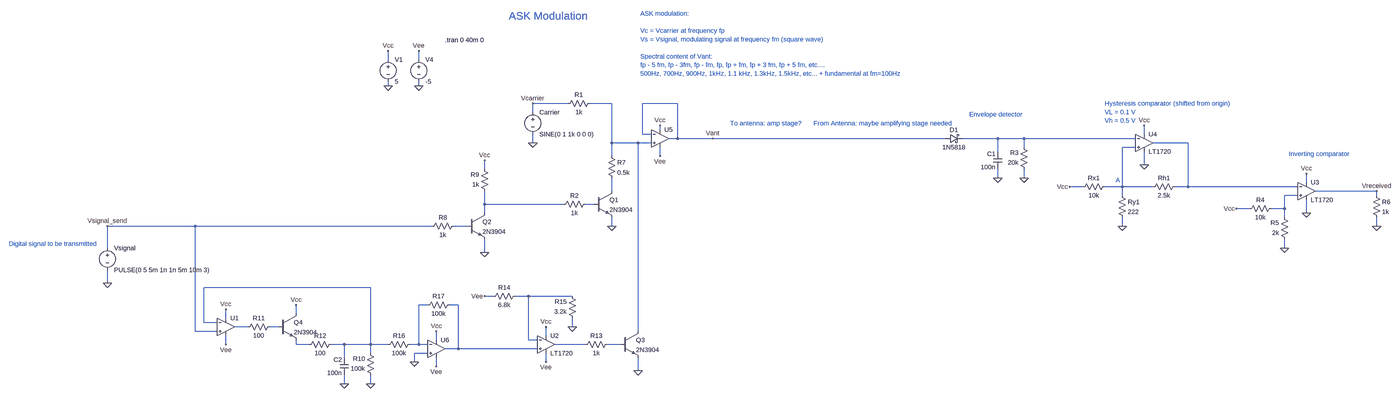
[diagram p0: schematic ASK-modulation2.asc, whole sheet]
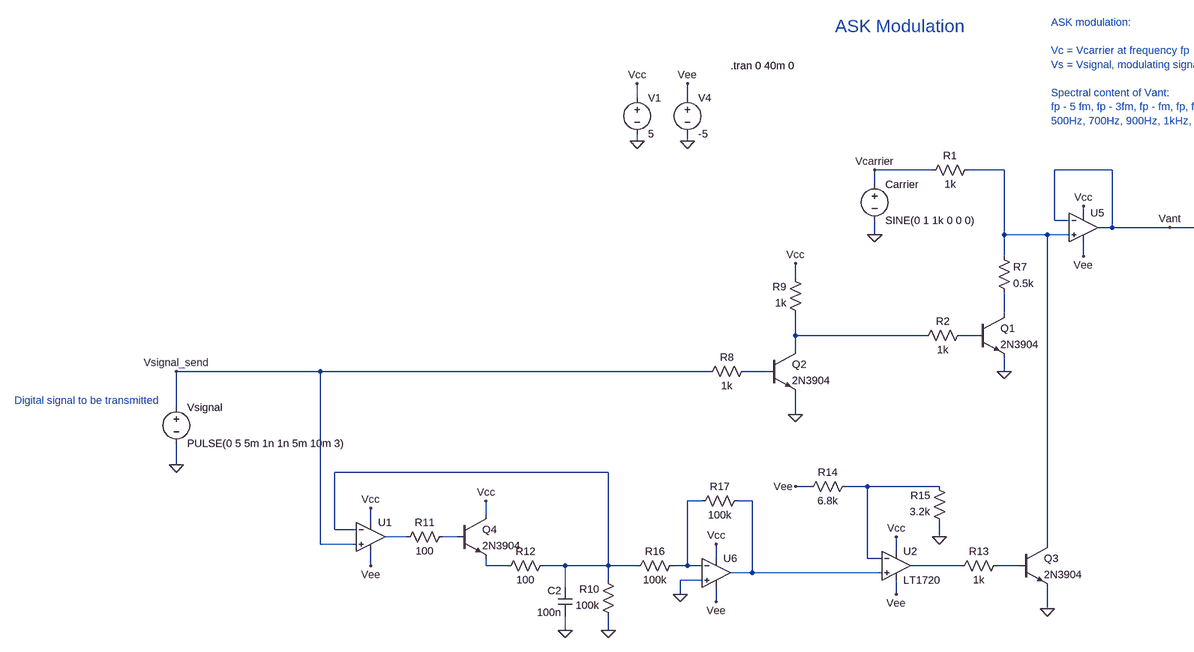
[diagram p1: schematic ASK-modulation2.asc, part, row 1 of 1, column 1 of 2]
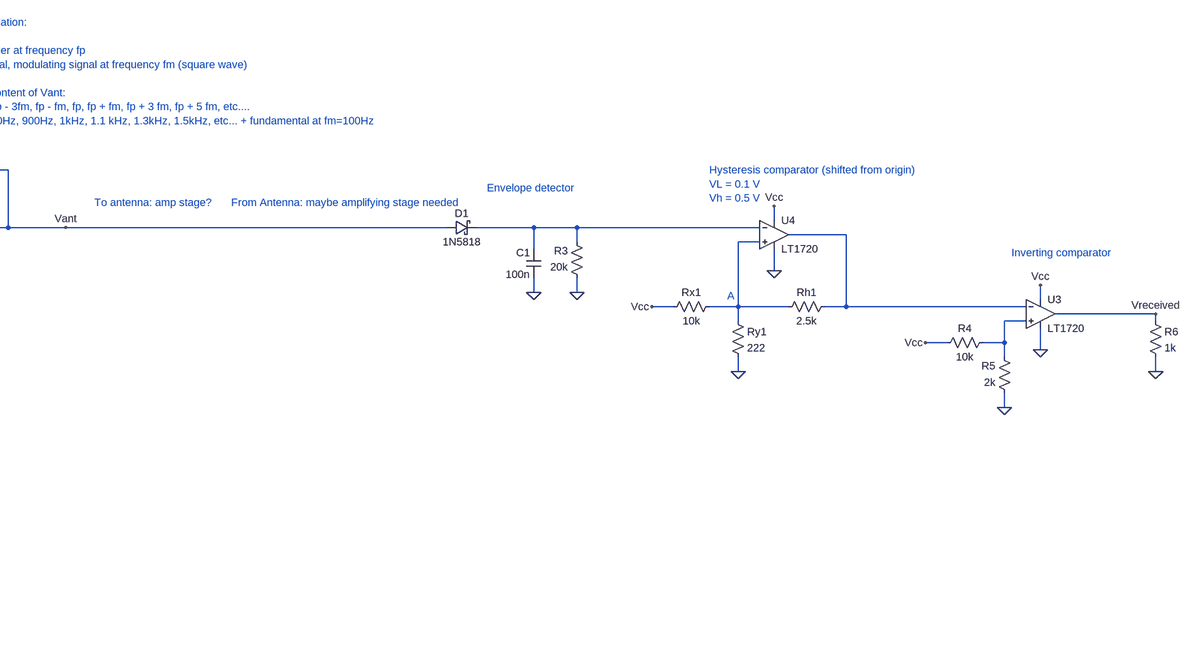
[diagram p2: schematic ASK-modulation2.asc, part, row 1 of 1, column 2 of 2]
ASK-modulation2.asc, the LTspice schematic file:
Version 4.1
SHEET 1 3624 1304
WIRE -1040 -96 -1040 -128
WIRE -928 -96 -928 -128
WIRE -1040 0 -1040 -16
WIRE -928 0 -928 -16
WIRE -384 64 -512 64
WIRE -224 64 -304 64
WIRE 16 64 -112 64
WIRE -512 96 -512 64
WIRE -48 160 -48 144
WIRE -112 176 -112 64
WIRE -80 176 -112 176
WIRE 1760 176 1760 144
WIRE 16 192 16 64
WIRE 16 192 -16 192
WIRE 144 192 16 192
WIRE 992 192 144 192
WIRE 1184 192 1056 192
WIRE 1280 192 1184 192
WIRE 1728 192 1280 192
WIRE -512 208 -512 176
WIRE -224 208 -224 64
WIRE -128 208 -224 208
WIRE -80 208 -128 208
WIRE 1920 208 1792 208
WIRE 1280 224 1280 192
WIRE 1728 224 1680 224
WIRE 1184 240 1184 192
WIRE -224 256 -224 208
WIRE -48 256 -48 224
WIRE 1760 288 1760 240
WIRE -688 304 -688 272
WIRE 1184 336 1184 304
WIRE 1280 336 1280 304
WIRE 2352 352 2352 320
WIRE 1536 368 1488 368
WIRE 1680 368 1680 224
WIRE 1680 368 1616 368
WIRE 1792 368 1680 368
WIRE 1920 368 1920 208
WIRE 1920 368 1872 368
WIRE 2320 368 1920 368
WIRE -224 384 -224 336
WIRE 2608 384 2384 384
WIRE 1680 400 1680 368
WIRE 2320 400 2272 400
WIRE 2608 400 2608 384
WIRE -688 432 -688 384
WIRE -400 432 -688 432
WIRE -288 432 -320 432
WIRE 2144 448 2096 448
WIRE 2272 448 2272 400
WIRE 2272 448 2224 448
WIRE -688 464 -688 432
WIRE 2352 464 2352 416
WIRE 2272 480 2272 448
WIRE -1744 512 -2064 512
WIRE -880 512 -1744 512
WIRE -752 512 -800 512
WIRE -224 512 -224 480
WIRE 1680 512 1680 480
WIRE 2608 512 2608 480
WIRE -2064 592 -2064 512
WIRE 2272 592 2272 560
WIRE -688 608 -688 560
WIRE -2064 720 -2064 672
WIRE -1104 736 -1712 736
WIRE -656 768 -688 768
WIRE -528 768 -576 768
WIRE -368 768 -528 768
WIRE -896 800 -928 800
WIRE -784 800 -816 800
WIRE -1376 832 -1376 800
WIRE -1632 848 -1632 816
WIRE -1712 864 -1712 736
WIRE -1664 864 -1712 864
WIRE -1552 880 -1600 880
WIRE -1440 880 -1472 880
WIRE -368 880 -368 848
WIRE -1744 896 -1744 512
WIRE -1664 896 -1744 896
WIRE -128 896 -128 208
WIRE -464 912 -464 880
WIRE -864 928 -864 896
WIRE -528 928 -528 768
WIRE -496 928 -528 928
WIRE -1632 944 -1632 912
WIRE -1376 944 -1376 928
WIRE -1328 944 -1376 944
WIRE -1200 944 -1248 944
WIRE -1104 944 -1104 736
WIRE -1104 944 -1200 944
WIRE -1040 944 -1104 944
WIRE -928 944 -928 800
WIRE -928 944 -960 944
WIRE -896 944 -928 944
WIRE -320 944 -432 944
WIRE -192 944 -240 944
WIRE -784 960 -784 800
WIRE -784 960 -832 960
WIRE -496 960 -784 960
WIRE -1104 976 -1104 944
WIRE -896 976 -944 976
WIRE -1200 992 -1200 944
WIRE -944 1008 -944 976
WIRE -464 1008 -464 976
WIRE -864 1024 -864 992
WIRE -128 1040 -128 992
WIRE -1200 1088 -1200 1056
WIRE -1104 1088 -1104 1056
FLAG -2064 720 0
FLAG -512 208 0
FLAG -224 512 0
FLAG -1040 0 0
FLAG -1040 -128 Vcc
FLAG -928 0 0
FLAG -928 -128 Vee
FLAG 1280 336 0
FLAG 1760 144 Vcc
FLAG 1680 512 0
FLAG 1760 288 0
FLAG 1488 368 Vcc
FLAG 2352 320 Vcc
FLAG 2352 464 0
FLAG 2272 592 0
FLAG 2096 448 Vcc
FLAG 2608 512 0
FLAG -48 144 Vcc
FLAG -48 256 Vee
FLAG 1184 336 0
FLAG 2608 384 Vreceived
FLAG 144 192 Vant
FLAG -688 272 Vcc
FLAG -688 608 0
FLAG -128 1040 0
FLAG -1104 1088 0
FLAG -1200 1088 0
FLAG -1632 816 Vcc
FLAG -1632 944 Vee
FLAG -1376 800 Vcc
FLAG -464 880 Vcc
FLAG -464 1008 Vee
FLAG -368 880 0
FLAG -2064 512 Vsignal_send
FLAG -944 1008 0
FLAG -864 1024 Vee
FLAG -864 896 Vcc
FLAG -688 768 Vee
FLAG -512 64 Vcarrier
SYMBOL voltage -1040 -112 R0
WINDOW 123 0 0 Left 0
WINDOW 39 0 0 Left 0
SYMATTR InstName V1
SYMATTR Value 5
SYMBOL voltage -512 80 R0
WINDOW 123 0 0 Left 0
WINDOW 39 0 0 Left 0
SYMATTR InstName Carrier
SYMATTR Value SINE(0 1 1k 0 0 0)
SYMBOL res -288 48 R90
WINDOW 0 0 56 VBottom 2
WINDOW 3 32 56 VTop 2
SYMATTR InstName R1
SYMATTR Value 1k
SYMBOL npn -288 384 R0
SYMATTR InstName Q1
SYMATTR Value 2N3904
SYMBOL voltage -2064 576 R0
WINDOW 123 0 0 Left 0
WINDOW 39 0 0 Left 0
SYMATTR InstName Vsignal
SYMATTR Value PULSE(0 5 5m 1n 1n 5m 10m 3)
SYMBOL voltage -928 -112 R0
WINDOW 123 0 0 Left 0
WINDOW 39 0 0 Left 0
SYMATTR InstName V4
SYMATTR Value -5
SYMBOL res -304 416 R90
WINDOW 0 0 56 VBottom 2
WINDOW 3 32 56 VTop 2
SYMATTR InstName R2
SYMATTR Value 1k
SYMBOL res 1296 320 R180
WINDOW 0 36 76 Left 2
WINDOW 3 36 40 Left 2
SYMATTR InstName R3
SYMATTR Value 20k
SYMBOL cap 1200 304 R180
WINDOW 0 24 56 Left 2
WINDOW 3 24 8 Left 2
SYMATTR InstName C1
SYMATTR Value 100n
SYMBOL res 1632 352 R90
WINDOW 0 0 56 VBottom 2
WINDOW 3 32 56 VTop 2
SYMATTR InstName Rx1
SYMATTR Value 10k
SYMBOL res 1664 384 R0
SYMATTR InstName Ry1
SYMATTR Value 222
SYMBOL res 1888 352 R90
WINDOW 0 0 56 VBottom 2
WINDOW 3 32 56 VTop 2
SYMATTR InstName Rh1
SYMATTR Value 2.5k
SYMBOL Comparators\\LT1720 1760 144 R0
SYMATTR InstName U4
SYMBOL Comparators\\LT1720 2352 320 R0
SYMATTR InstName U3
SYMBOL res 2240 432 R90
WINDOW 0 0 56 VBottom 2
WINDOW 3 32 56 VTop 2
SYMATTR InstName R4
SYMATTR Value 10k
SYMBOL res 2288 576 R180
WINDOW 0 36 76 Left 2
WINDOW 3 36 40 Left 2
SYMATTR InstName R5
SYMATTR Value 2k
SYMBOL res 2592 384 R0
SYMATTR InstName R6
SYMATTR Value 1k
SYMBOL Opamps\\UniversalOpamp2 -48 192 R0
SYMATTR InstName U5
SYMBOL schottky 992 208 R270
WINDOW 0 32 32 VTop 2
WINDOW 3 0 32 VBottom 2
SYMATTR InstName D1
SYMATTR Value 1N5818
SYMATTR Description Diode
SYMATTR Type diode
SYMBOL res -240 240 R0
SYMATTR InstName R7
SYMATTR Value 0.5k
SYMBOL npn -752 464 R0
SYMATTR InstName Q2
SYMATTR Value 2N3904
SYMBOL res -784 496 R90
WINDOW 0 0 56 VBottom 2
WINDOW 3 32 56 VTop 2
SYMATTR InstName R8
SYMATTR Value 1k
SYMBOL res -672 400 R180
WINDOW 0 36 76 Left 2
WINDOW 3 36 40 Left 2
SYMATTR InstName R9
SYMATTR Value 1k
SYMBOL npn -192 896 R0
SYMATTR InstName Q3
SYMATTR Value 2N3904
SYMBOL res -1088 1072 R180
WINDOW 0 36 76 Left 2
WINDOW 3 36 40 Left 2
SYMATTR InstName R10
SYMATTR Value 100k
SYMBOL cap -1184 1056 R180
WINDOW 0 24 56 Left 2
WINDOW 3 24 8 Left 2
SYMATTR InstName C2
SYMATTR Value 100n
SYMBOL npn -1440 832 R0
SYMATTR InstName Q4
SYMATTR Value 2N3904
SYMBOL res -1456 864 R90
WINDOW 0 0 56 VBottom 2
WINDOW 3 32 56 VTop 2
SYMATTR InstName R11
SYMATTR Value 100
SYMBOL res -1232 928 R90
WINDOW 0 0 56 VBottom 2
WINDOW 3 32 56 VTop 2
SYMATTR InstName R12
SYMATTR Value 100
SYMBOL res -224 928 R90
WINDOW 0 0 56 VBottom 2
WINDOW 3 32 56 VTop 2
SYMATTR InstName R13
SYMATTR Value 1k
SYMBOL Opamps\\UniversalOpamp2 -1632 880 R0
SYMATTR InstName U1
SYMBOL Comparators\\LT1720 -464 880 R0
SYMATTR InstName U2
SYMBOL res -560 752 R90
WINDOW 0 0 56 VBottom 2
WINDOW 3 32 56 VTop 2
SYMATTR InstName R14
SYMATTR Value 6.8k
SYMBOL res -352 864 R180
WINDOW 0 36 76 Left 2
WINDOW 3 36 40 Left 2
SYMATTR InstName R15
SYMATTR Value 3.2k
SYMBOL Opamps\\UniversalOpamp2 -864 960 R0
SYMATTR InstName U6
SYMBOL res -944 928 R90
WINDOW 0 0 56 VBottom 2
WINDOW 3 32 56 VTop 2
SYMATTR InstName R16
SYMATTR Value 100k
SYMBOL res -800 784 R90
WINDOW 0 0 56 VBottom 2
WINDOW 3 32 56 VTop 2
SYMATTR InstName R17
SYMATTR Value 100k
TEXT -600 -256 Left 4 ;ASK Modulation
TEXT -832 -168 Left 2 !.tran 0 40m 0
TEXT 208 136 Left 2 ;To antenna: amp stage?
TEXT 1656 344 Left 2 ;A
TEXT -2424 576 Left 2 ;Digital signal to be transmitted
TEXT 512 136 Left 2 ;From Antenna: maybe amplifying stage needed
TEXT 1080 104 Left 2 ;Envelope detector
TEXT 1616 64 Left 2 ;Hysteresis comparator (shifted from origin)\nVL = 0.1 V\nVh = 0.5 V
TEXT 2288 248 Left 2 ;Inverting comparator
TEXT -120 -264 Left 2 ;ASK modulation:\n \nVc = Vcarrier at frequency fp\nVs = Vsignal, modulating signal at frequency fm (square wave)\n \nSpectral content of Vant:\nfp - 5 fm, fp - 3fm, fp - fm, fp, fp + fm, fp + 3 fm, fp + 5 fm, etc....\n500Hz, 700Hz, 900Hz, 1kHz, 1.1 kHz, 1.3kHz, 1.5kHz, etc... + fundamental at fm=100Hz

The netlist it stands for:
* ASK-modulation2.asc
V1 Vcc 0 5
V§Carrier Vcarrier 0 SINE(0 1 1k 0 0 0)
R1 N001 Vcarrier 1k
Q1 N005 N008 0 0 2N3904
Vsignal Vsignal_send 0 PULSE(0 5 5m 1n 1n 5m 10m 3)
V4 Vee 0 -5
R2 N008 N007 1k
R3 0 N002 20k
C1 0 N002 100n
Rx1 N004 Vcc 10k
Ry1 N004 0 222
Rh1 N003 N004 2.5k
X§U4 N004 N002 Vcc 0 N003 LT1720  ; pins In+ In- V+ V- OUT
X§U3 N006 N003 Vcc 0 Vreceived LT1720  ; pins In+ In- V+ V- OUT
R4 N006 Vcc 10k
R5 0 N006 2k
R6 Vreceived 0 1k
X§U5 N001 Vant Vcc Vee Vant level.2 Avol=1Meg GBW=10Meg Slew=10Meg ilimit=25m rail=0 Vos=0 phimargin=45 en=0 enk=0 in=0 ink=0 Rin=500Meg  ; pins IN+ IN- V+ V- OUT
D1 Vant N002 1N5818
R7 N001 N005 0.5k
Q2 N007 N009 0 0 2N3904
R8 N009 Vsignal_send 1k
R9 N007 Vcc 1k
Q3 N001 N018 0 0 2N3904
R10 0 N010 100k
C2 0 N010 100n
Q4 Vcc N015 N016 0 2N3904
R11 N015 N014 100
R12 N010 N016 100
R13 N018 N017 1k
X§U1 Vsignal_send N010 Vcc Vee N014 level.2 Avol=1Meg GBW=10Meg Slew=10Meg ilimit=25m rail=0 Vos=0 phimargin=45 en=0 enk=0 in=0 ink=0 Rin=500Meg  ; pins IN+ IN- V+ V- OUT
X§U2 N013 N011 Vcc Vee N017 LT1720  ; pins In+ In- V+ V- OUT
R14 N011 Vee 6.8k
R15 0 N011 3.2k
X§U6 0 N012 Vcc Vee N013 level.2 Avol=1Meg GBW=10Meg Slew=10Meg ilimit=25m rail=0 Vos=0 phimargin=45 en=0 enk=0 in=0 ink=0 Rin=500Meg  ; pins IN+ IN- V+ V- OUT
R16 N012 N010 100k
R17 N013 N012 100k
.model D D
.lib standard.dio
.model NPN NPN
.model PNP PNP
.lib standard.bjt
* ASK Modulation
.tran 0 40m 0
* To antenna: amp stage?
* A
* Digital signal to be transmitted
* From Antenna: maybe amplifying stage needed
* Envelope detector
* Hysteresis comparator (shifted from origin)
* VL = 0.1 V
* Vh = 0.5 V
* Inverting comparator
* ASK modulation:
* Vc = Vcarrier at frequency fp
* Vs = Vsignal, modulating signal at frequency fm (square wave)
* Spectral content of Vant:
* fp - 5 fm, fp - 3fm, fp - fm, fp, fp + fm, fp + 3 fm, fp + 5 fm, etc....
* 500Hz, 700Hz, 900Hz, 1kHz, 1.1 kHz, 1.3kHz, 1.5kHz, etc... + fundamental at fm=100Hz
.lib LT1720.sub
.lib UniversalOpamps2.sub
.backanno
.end